# EAGLE schematic OV7670 (EAGLE 6.1)
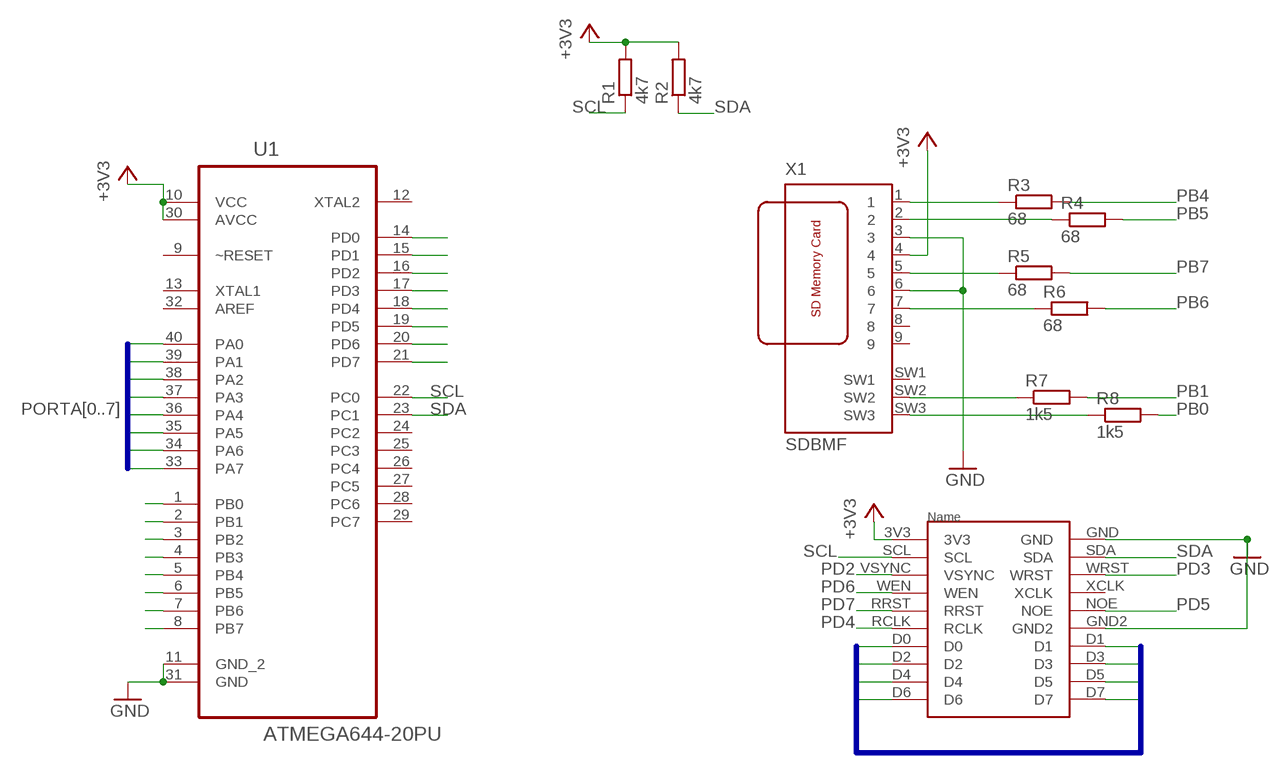
[diagram p0: schematic, sheet 1]

## Parts
OV7670  OV7670  [OV7670]
R1  4k7  R-EU_0204/5  [0204/5]
R2  4k7  R-EU_0204/5  [0204/5]
R3  68  R-EU_0204/5  [0204/5]
R4  68  R-EU_0204/5  [0204/5]
R5  68  R-EU_0204/5  [0204/5]
R6  68  R-EU_0204/5  [0204/5]
R7  1k5  R-EU_0204/5  [0204/5]
R8  1k5  R-EU_0204/5  [0204/5]
U1  ATMEGA644-20PU  [DIP254P1524X482-40]
X1  SDBMF  [SDBMF-009XXBXX2]

## Nets
+3V3: OV7670.3V3 R1.2 R2.2 U1.10(VCC) U1.30(AVCC) X1.4
GND: OV7670.GND OV7670.GND2 U1.11(GND_2) U1.31(GND) X1.3 X1.6
N$2: R3.1 X1.1
N$3: R4.1 X1.2
N$4: R6.1 X1.7
N$5: R5.1 X1.5
N$6: R7.1 X1.SW2
N$7: R8.1 X1.SW3
PA7: U1.33(PA7)
PB0: R8.2 U1.1(PB0)
PB1: R7.2 U1.2(PB1)
PB2: U1.3(PB2)
PB3: U1.4(PB3)
PB4: R3.2 U1.5(PB4)
PB5: R4.2 U1.6(PB5)
PB6: R6.2 U1.7(PB6)
PB7: R5.2 U1.8(PB7)
PD0: U1.14(PD0)
PD1: U1.15(PD1)
PD2: OV7670.VSYNC U1.16(PD2)
PD3: OV7670.WRST U1.17(PD3)
PD4: OV7670.RCLK U1.18(PD4)
PD5: OV7670.NOE U1.19(PD5)
PD6: OV7670.WEN U1.20(PD6)
PD7: OV7670.RRST U1.21(PD7)
PORTA0: OV7670.D0 U1.40(PA0)
PORTA1: OV7670.D1 U1.39(PA1)
PORTA2: OV7670.D2 U1.38(PA2)
PORTA3: OV7670.D3 U1.37(PA3)
PORTA4: OV7670.D4 U1.36(PA4)
PORTA5: OV7670.D5 U1.35(PA5)
PORTA6: OV7670.D6 U1.34(PA6)
PORTA7: OV7670.D7
SCL: OV7670.SCL R1.1 U1.22(PC0)
SDA: OV7670.SDA R2.1 U1.23(PC1)
Unconnected: OV7670.XCLK U1.9(~RESET) U1.12(XTAL2) U1.13(XTAL1) U1.24(PC2) U1.25(PC3) U1.26(PC4) U1.27(PC5) U1.28(PC6) U1.29(PC7) U1.32(AREF) X1.8 X1.9 X1.SW1

## Buses
PORTA[0..7]

## Library data of the parts
OV7670 = seblov:OV7670
R1-R8 = resistor:R-EU_: RESISTOR, European symbol
U1 = Atmel_By_element14_Batch_1:ATMEGA644-20PU: 8-bit Microcontroller with 64K Bytes In-System Programmable Flash; MPN: ATMEGA644-20PU; OC_FARNELL: 1288340; OC_NEWARK: 23M5060; PACKAGE: DIP-40; SUPPLIER: Atmel
X1 = farnell:SDBMF: SD MEMORY CARD PUSH-PUSH WITH CONNECTOR TYPE B (BIG SWUÌTCH #3) KINGFONT PRECISION INDUSTIAL CO., LTD Source: http://www.farnell.com/datasheets/74273.pdf Best.-Nr.: 9186174 Hersteller: MULTICOMP Herstellerbez.: SDBMF-00915B0T2